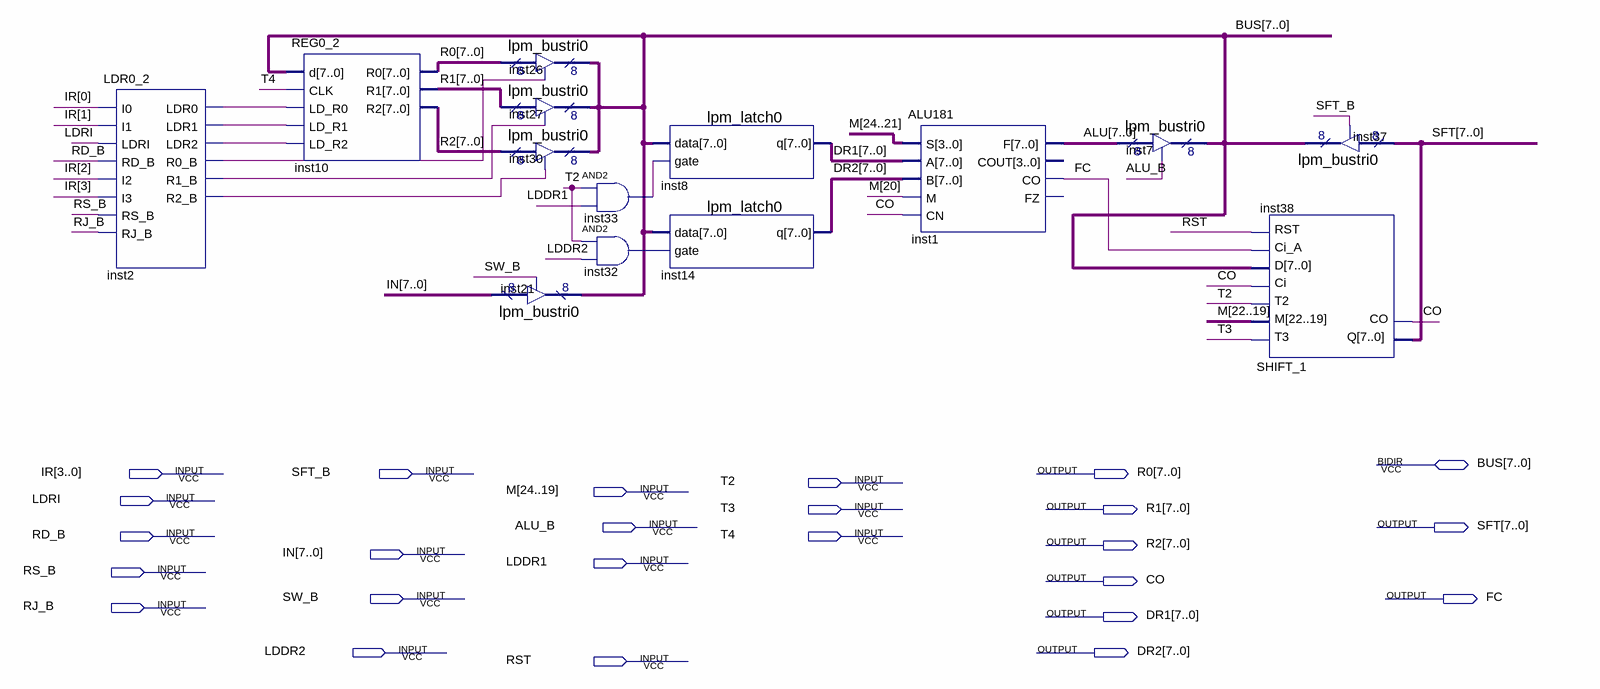
[diagram p0: schematic sheet]
// Quartus schematic ALU_MD_G.bdf as structural Verilog: 14 symbols, 25 pins
module ALU_MD_G (
  input  [3:0] IR,
  input  SFT_B,
  input  T2,
  input  [24:19] M,
  input  LDRI,
  input  T3,
  input  ALU_B,
  input  RD_B,
  input  T4,
  input  [7:0] IN,
  input  LDDR1,
  input  RS_B,
  input  SW_B,
  input  RJ_B,
  input  LDDR2,
  input  RST,
  inout  [7:0] BUS,
  output [7:0] R0,
  output [7:0] R1,
  output [7:0] SFT,
  output [7:0] R2,
  output CO,
  output FC,
  output [7:0] DR1,
  output [7:0] DR2
);

  wire inst2_ldr0, inst2_ldr1, inst2_ldr2, inst2_r0_b, inst2_r1_b, inst2_r2_b, inst32_out, inst33_out;
  wire [7:0] ALU;

  LDR0_2 inst2 (
    .I0(IR[0]), .I1(IR[1]), .LDRI(LDRI), .RD_B(RD_B), .I2(IR[2]), .I3(IR[3]), .RS_B(RS_B), .RJ_B(RJ_B),
    .LDR0(inst2_ldr0), .LDR1(inst2_ldr1), .LDR2(inst2_ldr2), .R0_B(inst2_r0_b), .R1_B(inst2_r1_b),
    .R2_B(inst2_r2_b));
  REG0_2 inst10 (
    .d(BUS), .CLK(T4), .LD_R0(inst2_ldr0), .LD_R1(inst2_ldr1), .LD_R2(inst2_ldr2), .R0(R0), .R1(R1), .R2(R2));
  lpm_bustri0 inst26 (.enabledt(inst2_r0_b), .data(R0), .tridata(BUS));
  lpm_bustri0 inst27 (.enabledt(inst2_r1_b), .data(R1), .tridata(BUS));
  lpm_bustri0 inst30 (.enabledt(inst2_r2_b), .data(R2), .tridata(BUS));
  lpm_bustri0 inst21 (.enabledt(SW_B), .data(IN), .tridata(BUS));
  and inst33 (inst33_out, T2, LDDR1);
  and inst32 (inst32_out, T2, LDDR2);
  lpm_latch0 inst8 (.data(BUS), .gate(inst33_out), .q(DR1));
  lpm_latch0 inst14 (.data(BUS), .gate(inst32_out), .q(DR2));
  ALU181 inst1 (.S(M[24:21]), .A(DR1), .B(DR2), .M(M[20]), .CN(CO), .F(ALU), .CO(FC));  // open: COUT, FZ
  lpm_bustri0 inst7 (.enabledt(ALU_B), .data(ALU), .tridata(BUS));
  lpm_bustri0 inst37 (.enabledt(SFT_B), .data(SFT), .tridata(BUS));
  SHIFT_1 inst38 (.T3(T3), .M(M[22:19]), .T2(T2), .Ci(CO), .D(BUS), .Ci_A(FC), .RST(RST), .Q(SFT), .CO(CO));
endmodule
